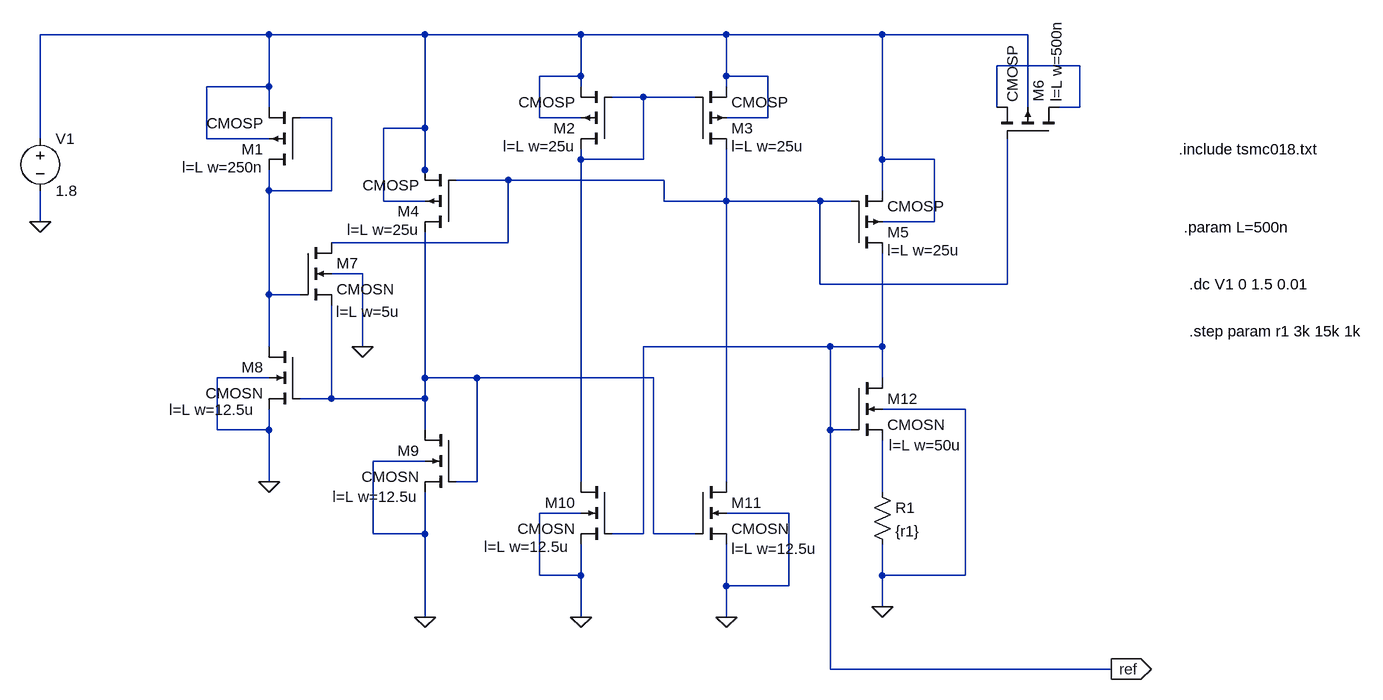
[diagram p0: schematic Vref.asc]
Vref.asc, the LTspice schematic file:
Version 4
SHEET 1 1600 680
WIRE -176 -832 -528 -832
WIRE 64 -832 -176 -832
WIRE 304 -832 64 -832
WIRE 528 -832 304 -832
WIRE 768 -832 528 -832
WIRE 992 -832 768 -832
WIRE 1072 -784 944 -784
WIRE 304 -768 304 -832
WIRE 304 -768 240 -768
WIRE 528 -768 528 -832
WIRE 592 -768 528 -768
WIRE -176 -752 -176 -832
WIRE -176 -752 -272 -752
WIRE 304 -752 304 -768
WIRE 528 -752 528 -768
WIRE 400 -736 352 -736
WIRE 480 -736 400 -736
WIRE -176 -720 -176 -752
WIRE 944 -720 944 -784
WIRE 992 -720 992 -832
WIRE 1072 -720 1072 -784
WIRE 1072 -720 1040 -720
WIRE -80 -704 -128 -704
WIRE 240 -704 240 -768
WIRE 304 -704 240 -704
WIRE 592 -704 592 -768
WIRE 592 -704 528 -704
WIRE 64 -688 64 -832
WIRE 64 -688 0 -688
WIRE -528 -672 -528 -832
WIRE -272 -672 -272 -752
WIRE -176 -672 -272 -672
WIRE 304 -640 304 -656
WIRE 400 -640 400 -736
WIRE 400 -640 304 -640
WIRE 768 -640 768 -832
WIRE 848 -640 768 -640
WIRE 64 -624 64 -688
WIRE 64 -608 64 -624
WIRE 192 -608 112 -608
WIRE 432 -608 192 -608
WIRE -176 -592 -176 -624
WIRE -80 -592 -80 -704
WIRE -80 -592 -176 -592
WIRE 768 -592 768 -640
WIRE 0 -576 0 -688
WIRE 64 -576 0 -576
WIRE 432 -576 432 -608
WIRE 528 -576 528 -656
WIRE 528 -576 432 -576
WIRE 672 -576 528 -576
WIRE 720 -576 672 -576
WIRE -528 -544 -528 -592
WIRE 848 -544 848 -640
WIRE 848 -544 768 -544
WIRE 192 -512 192 -608
WIRE 192 -512 -80 -512
WIRE -32 -464 -80 -464
WIRE 672 -448 672 -576
WIRE 960 -448 960 -672
WIRE 960 -448 672 -448
WIRE -176 -432 -176 -592
WIRE -128 -432 -176 -432
WIRE -176 -352 -176 -432
WIRE -32 -352 -32 -464
WIRE 688 -352 400 -352
WIRE 768 -352 768 -496
WIRE 768 -352 688 -352
WIRE -176 -304 -256 -304
WIRE 64 -304 64 -528
WIRE 144 -304 64 -304
WIRE 416 -304 144 -304
WIRE 768 -304 768 -352
WIRE -80 -272 -80 -416
WIRE -80 -272 -128 -272
WIRE 64 -272 64 -304
WIRE 64 -272 -80 -272
WIRE 896 -256 768 -256
WIRE -256 -224 -256 -304
WIRE -176 -224 -176 -256
WIRE -176 -224 -256 -224
WIRE 64 -224 64 -272
WIRE 688 -224 688 -352
WIRE 720 -224 688 -224
WIRE 64 -176 -16 -176
WIRE -176 -144 -176 -224
WIRE 144 -144 144 -304
WIRE 144 -144 112 -144
WIRE 304 -144 304 -640
WIRE 528 -144 528 -576
WIRE 768 -128 768 -208
WIRE 304 -96 240 -96
WIRE 624 -96 528 -96
WIRE -16 -64 -16 -176
WIRE 64 -64 64 -128
WIRE 64 -64 -16 -64
WIRE 400 -64 400 -352
WIRE 400 -64 352 -64
WIRE 416 -64 416 -304
WIRE 480 -64 416 -64
WIRE 240 0 240 -96
WIRE 304 0 304 -48
WIRE 304 0 240 0
WIRE 768 0 768 -48
WIRE 896 0 896 -256
WIRE 896 0 768 0
WIRE 528 16 528 -48
WIRE 624 16 624 -96
WIRE 624 16 528 16
WIRE 768 48 768 0
WIRE 64 64 64 -64
WIRE 304 64 304 0
WIRE 528 64 528 16
WIRE 688 144 688 -224
WIRE 1120 144 688 144
FLAG -528 -544 0
FLAG -32 -352 0
FLAG -176 -144 0
FLAG 64 64 0
FLAG 304 64 0
FLAG 528 64 0
FLAG 768 48 0
FLAG 1120 144 ref
IOPIN 1120 144 Out
SYMBOL voltage -528 -688 R0
WINDOW 123 0 0 Left 0
WINDOW 39 0 0 Left 0
SYMATTR InstName V1
SYMATTR Value 1.8
SYMBOL pmos4 -128 -624 R180
WINDOW 123 56 4 Left 2
SYMATTR Value2 l=L w=250n
SYMATTR InstName M1
SYMATTR Value CMOSP
SYMBOL pmos4 352 -656 R180
WINDOW 123 56 4 Left 2
SYMATTR Value2 l=L w=25u
SYMATTR InstName M2
SYMATTR Value CMOSP
SYMBOL pmos4 480 -656 M180
WINDOW 123 56 4 Left 2
SYMATTR Value2 l=L w=25u
SYMATTR InstName M3
SYMATTR Value CMOSP
SYMBOL pmos4 112 -528 R180
WINDOW 123 56 4 Left 2
SYMATTR Value2 l=L w=25u
SYMATTR InstName M4
SYMATTR Value CMOSP
SYMBOL pmos4 720 -496 M180
WINDOW 123 56 4 Left 2
SYMATTR Value2 l=L w=25u
SYMATTR InstName M5
SYMATTR Value CMOSP
SYMBOL pmos4 1040 -672 M270
WINDOW 123 56 4 Left 2
SYMATTR Value2 l=L w=500n
SYMATTR InstName M6
SYMATTR Value CMOSP
SYMBOL nmos4 -128 -512 R0
WINDOW 123 55 106 Left 2
SYMATTR Value2 l=L w=5u
SYMATTR InstName M7
SYMATTR Value CMOSN
SYMBOL nmos4 -128 -352 M0
WINDOW 123 70 97 Left 2
SYMATTR Value2 l=L w=12.5u
SYMATTR InstName M8
SYMATTR Value CMOSN
SYMBOL nmos4 112 -224 M0
WINDOW 123 58 103 Left 2
SYMATTR Value2 l=L w=12.5u
SYMATTR InstName M9
SYMATTR Value CMOSN
SYMBOL nmos4 352 -144 M0
WINDOW 123 65 100 Left 2
SYMATTR Value2 l=L w=12.5u
SYMATTR InstName M10
SYMATTR Value CMOSN
SYMBOL nmos4 480 -144 R0
WINDOW 123 56 103 Left 2
SYMATTR Value2 l=L w=12.5u
SYMATTR InstName M11
SYMATTR Value CMOSN
SYMBOL nmos4 720 -304 R0
WINDOW 123 58 104 Left 2
SYMATTR Value2 l=L w=50u
SYMATTR InstName M12
SYMATTR Value CMOSN
SYMBOL res 752 -144 R0
SYMATTR InstName R1
SYMATTR Value {r1}
TEXT 1224 -656 Left 2 !.include tsmc018.txt
TEXT 1232 -536 Left 2 !.param L=500n
TEXT 1240 -448 Left 2 !.dc V1 0 1.5 0.01
TEXT 1240 -376 Left 2 !.step param r1 3k 15k 1k

The netlist it stands for:
* Vref.asc
V1 N001 0 1.8
M1 N004 N004 N001 N001 CMOSP l=L w=250n
M2 N003 N003 N001 N001 CMOSP l=L w=25u
M3 N005 N003 N001 N001 CMOSP l=L w=25u
M4 N006 N005 N001 N001 CMOSP l=L w=25u
M5 ref N005 N001 N001 CMOSP l=L w=25u
M6 N002 N005 N002 N001 CMOSP l=L w=500n
M7 N005 N004 N006 0 CMOSN l=L w=5u
M8 N004 N006 0 0 CMOSN l=L w=12.5u
M9 N006 N006 0 0 CMOSN l=L w=12.5u
M10 N003 ref 0 0 CMOSN l=L w=12.5u
M11 N005 N006 0 0 CMOSN l=L w=12.5u
M12 ref ref N007 0 CMOSN l=L w=50u
R1 N007 0 {r1}
.model NMOS NMOS
.model PMOS PMOS
.lib standard.mos
.include tsmc018.txt
.param L=500n
.dc V1 0 1.5 0.01
.step param r1 3k 15k 1k
.backanno
.end